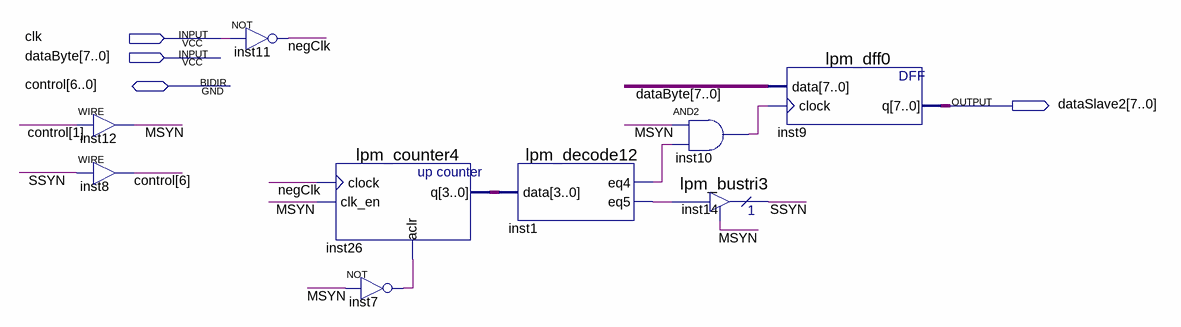
[diagram p0: schematic sheet]
// Quartus schematic Slave2.bdf as structural Verilog: 9 symbols, 4 pins
module Slave2 (
  input  clk,
  input  [7:0] dataByte,
  inout  [6:0] control,
  output [7:0] dataSlave2
);

  wire inst1_eq4, inst1_eq5, inst7_out, inst10_out, MSYN, negClk, SSYN;
  wire [3:0] inst26_q;

  assign MSYN = control[1];  // WIRE inst12
  assign control[6] = SSYN;  // WIRE inst8
  not inst11 (negClk, clk);
  lpm_counter4 inst26 (.clock(negClk), .clk_en(MSYN), .aclr(inst7_out), .q(inst26_q));
  not inst7 (inst7_out, MSYN);
  lpm_decode12 inst1 (.data(inst26_q), .eq4(inst1_eq4), .eq5(inst1_eq5));
  and inst10 (inst10_out, MSYN, inst1_eq4);
  lpm_bustri3 inst14 (.enabledt(MSYN), .data(inst1_eq5), .tridata(SSYN));
  lpm_dff0 inst9 (.data(dataByte), .clock(inst10_out), .q(dataSlave2));
endmodule
